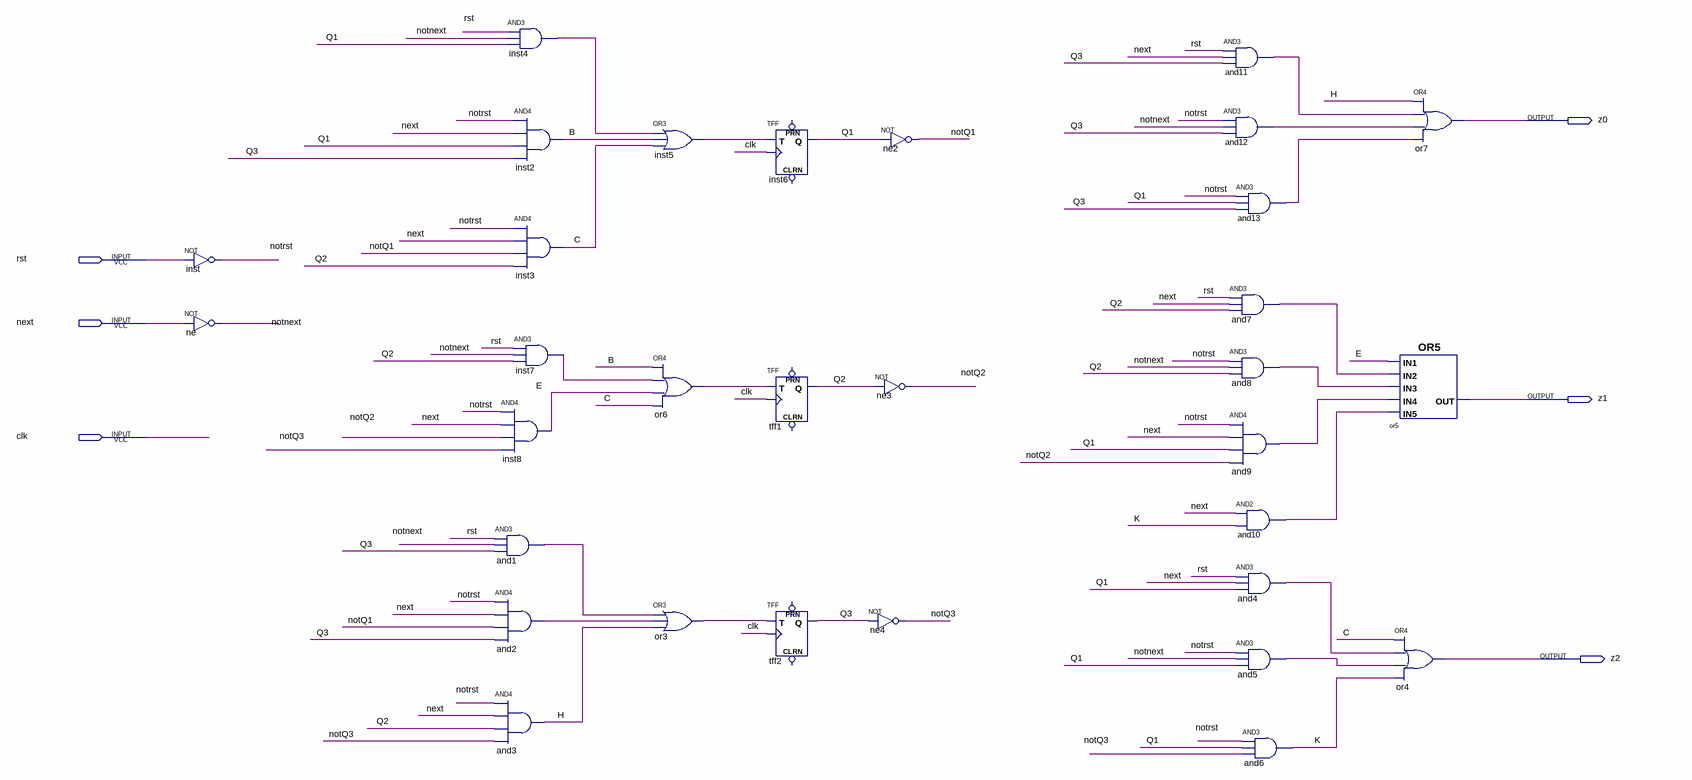
[diagram p0: schematic sheet]
// Quartus schematic PRandom07.bdf as structural Verilog: 32 symbols, 6 pins
module PRandom07 (
  input  rst,
  input  next,
  input  clk,
  output z0,
  output z1,
  output z2
);

  wire and1_out, and2_out, and4_out, and5_out, and7_out, and8_out, and9_out, and10_out, and11_out, and12_out,
       and13_out, B, C, E, H, inst4_out, inst5_out, inst7_out, K, notnext, notQ1, notQ2, notQ3, notrst,
       or3_out, or6_out, Q1, Q2, Q3;

  not inst (notrst, rst);
  not ne (notnext, next);
  and and1 (and1_out, rst, notnext, Q3);
  and and2 (and2_out, notrst, next, notQ1, Q3);
  and and3 (H, notrst, next, Q2, notQ3);
  and inst4 (inst4_out, rst, notnext, Q1);
  and inst2 (B, notrst, next, Q1, Q3);
  and inst3 (C, notrst, next, notQ1, Q2);
  and inst7 (inst7_out, rst, notnext, Q2);
  and inst8 (E, notrst, next, notQ2, notQ3);
  or inst5 (inst5_out, inst4_out, B, C);
  or or6 (or6_out, B, inst7_out, E, C);
  or or3 (or3_out, and1_out, and2_out, H);
  TFF inst6 (.T(inst5_out), .CLK(clk), .Q(Q1));  // open: PRN, CLRN
  TFF tff1 (.T(or6_out), .CLK(clk), .Q(Q2));  // open: PRN, CLRN
  TFF tff2 (.T(or3_out), .CLK(clk), .Q(Q3));  // open: PRN, CLRN
  not ne2 (notQ1, Q1);
  not ne3 (notQ2, Q2);
  not ne4 (notQ3, Q3);
  and and11 (and11_out, rst, next, Q3);
  and and12 (and12_out, notrst, notnext, Q3);
  and and13 (and13_out, notrst, Q1, Q3);
  and and7 (and7_out, rst, next, Q2);
  and and8 (and8_out, notrst, notnext, Q2);
  and and9 (and9_out, notrst, next, Q1, notQ2);
  and and10 (and10_out, next, K);
  and and4 (and4_out, rst, next, Q1);
  and and5 (and5_out, notrst, notnext, Q1);
  and and6 (K, notrst, Q1, notQ3);
  or or5 (z1, E, and7_out, and8_out, and9_out, and10_out);
  or or4 (z2, C, and4_out, and5_out, K);
  or or7 (z0, H, and11_out, and12_out, and13_out);
endmodule
